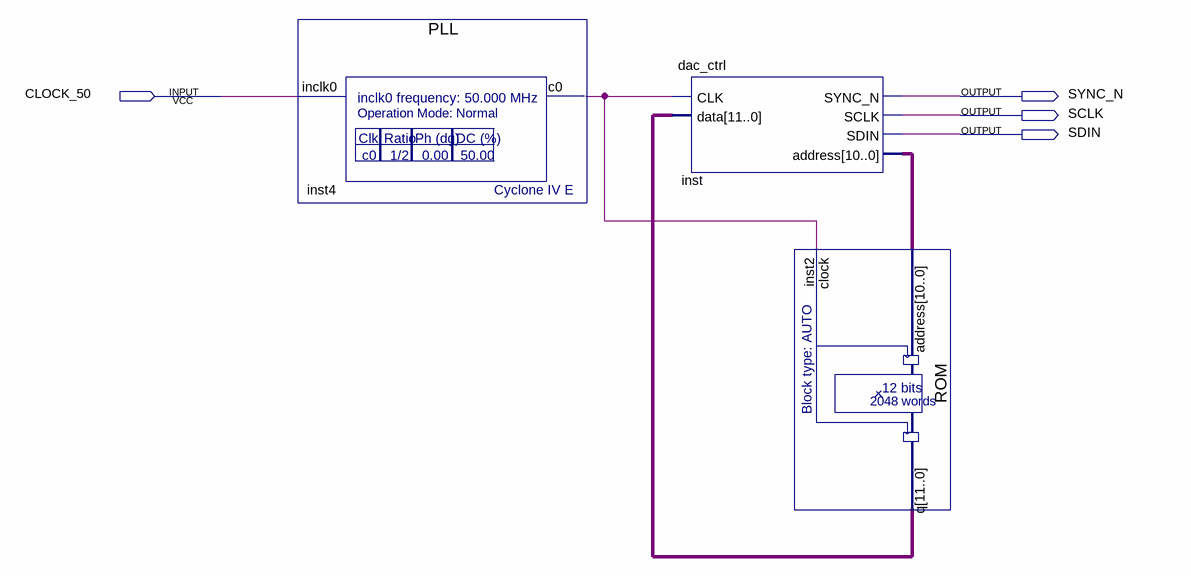
[diagram p0: schematic sheet]
// Quartus schematic dac.bdf as structural Verilog: 3 symbols, 4 pins
module dac (
  input  CLOCK_50,
  output SYNC_N,
  output SCLK,
  output SDIN
);

  wire inst4_c0;
  wire [10:0] inst_address;
  wire [11:0] inst2_q;

  PLL inst4 (.inclk0(CLOCK_50), .c0(inst4_c0));
  dac_ctrl inst (.CLK(inst4_c0), .data(inst2_q), .SYNC_N(SYNC_N), .SCLK(SCLK), .SDIN(SDIN), .address(inst_address));
  ROM inst2 (.address(inst_address), .clock(inst4_c0), .q(inst2_q));
endmodule
